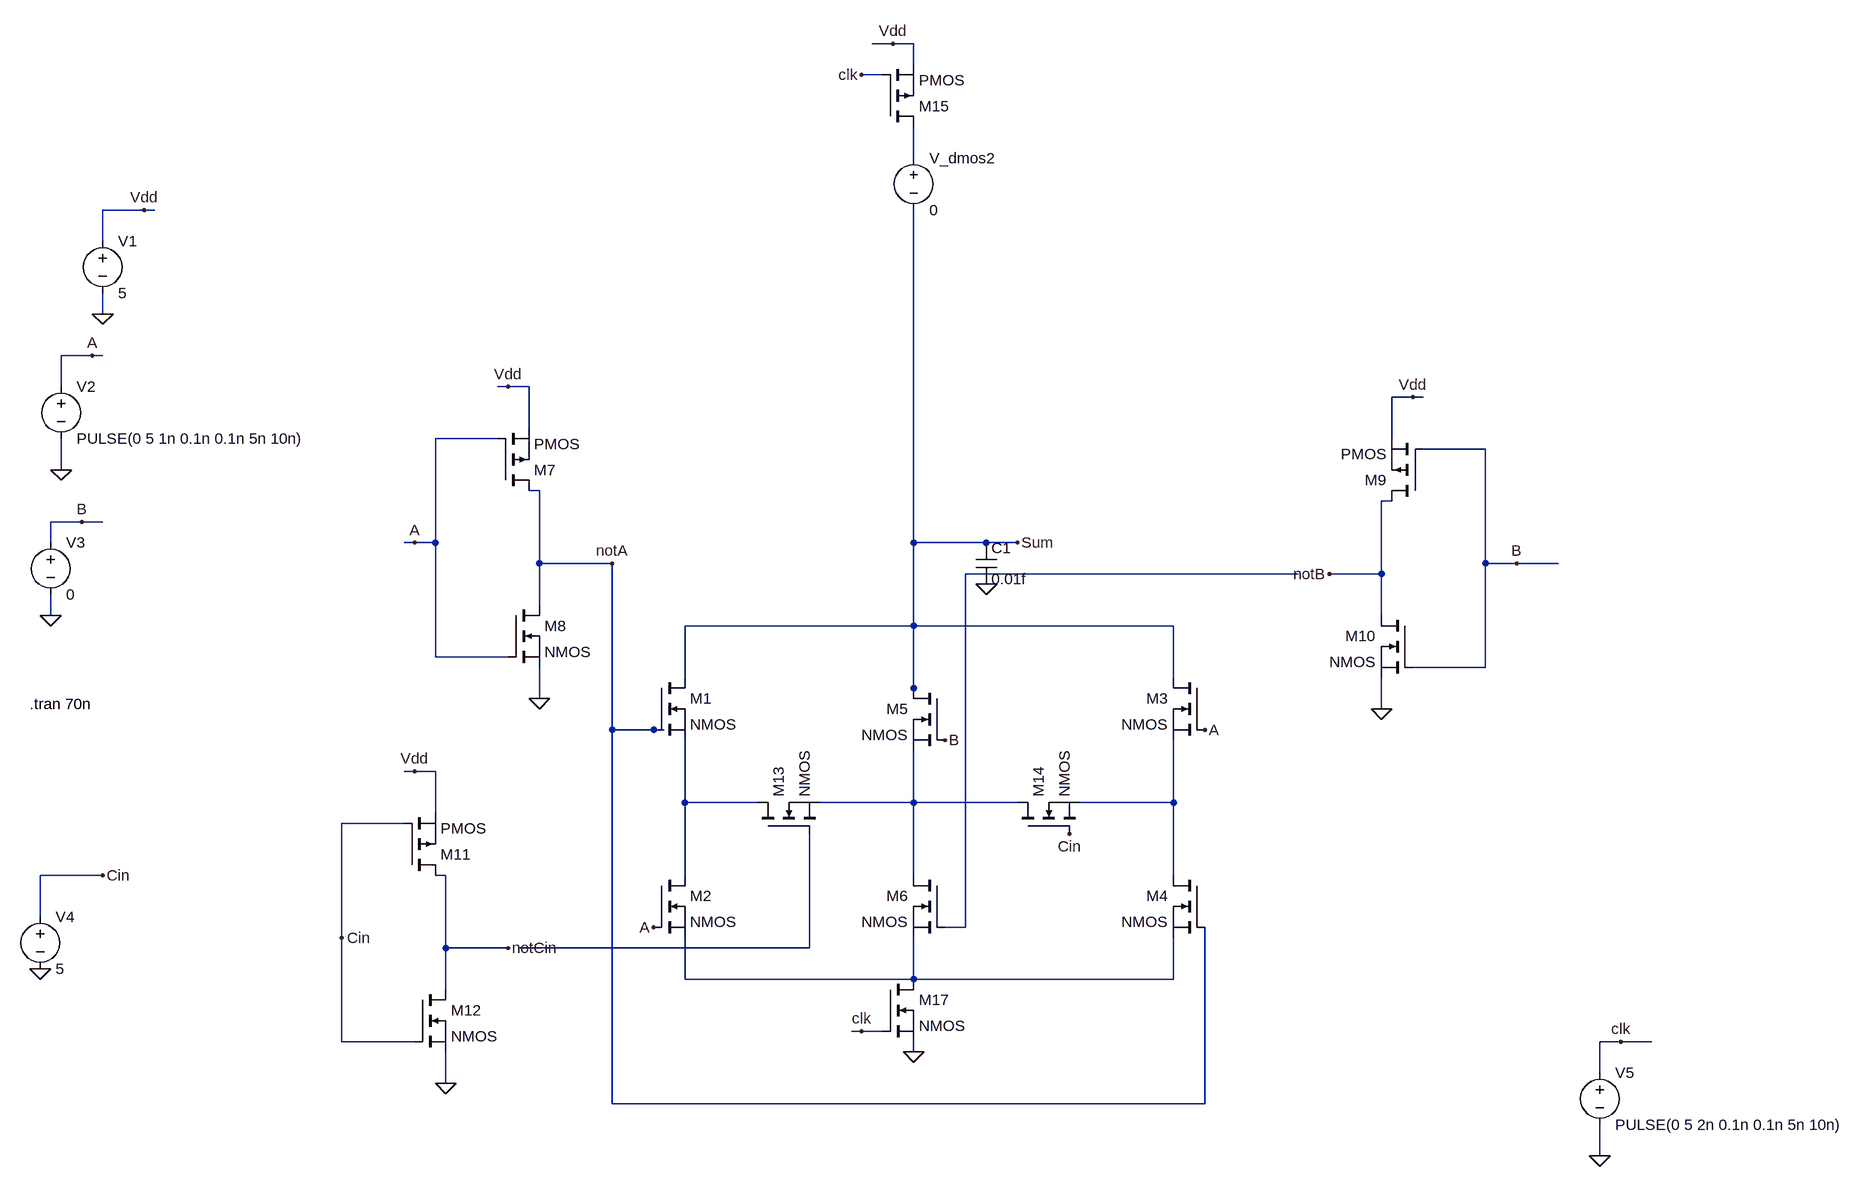
[diagram p0: schematic Sum3.asc]
Sum3.asc, the LTspice schematic file:
Version 4
SHEET 1 1772 932
WIRE 160 -816 128 -816
WIRE 192 -816 160 -816
WIRE 192 -784 192 -816
WIRE 144 -768 112 -768
WIRE 192 -640 192 -688
WIRE -992 -560 -1056 -560
WIRE -976 -560 -992 -560
WIRE -1056 -512 -1056 -560
WIRE -1056 -400 -1056 -432
WIRE -1072 -336 -1120 -336
WIRE -1056 -336 -1072 -336
WIRE -1120 -288 -1120 -336
WIRE -432 -288 -448 -288
WIRE -400 -288 -432 -288
WIRE 960 -272 928 -272
WIRE 976 -272 960 -272
WIRE -400 -224 -400 -288
WIRE -448 -208 -544 -208
WIRE 928 -208 928 -272
WIRE 1072 -192 976 -192
WIRE -1120 -160 -1120 -208
WIRE -384 -128 -400 -128
WIRE 928 -112 912 -112
WIRE -1088 -80 -1136 -80
WIRE -1056 -80 -1088 -80
WIRE -1136 -48 -1136 -80
WIRE -576 -48 -592 -48
WIRE -544 -48 -544 -208
WIRE -544 -48 -576 -48
WIRE 192 -48 192 -560
WIRE 304 -48 192 -48
WIRE 352 -48 304 -48
WIRE -384 -16 -384 -128
WIRE -272 -16 -384 -16
WIRE 1072 -16 1072 -192
WIRE 1120 -16 1072 -16
WIRE 1184 -16 1120 -16
WIRE 784 0 272 0
WIRE 912 0 912 -112
WIRE 912 0 832 0
WIRE -384 48 -384 -16
WIRE -1136 64 -1136 32
WIRE 912 64 912 0
WIRE 192 80 192 -48
WIRE 192 80 -160 80
WIRE 592 80 192 80
WIRE -544 128 -544 -48
WIRE -432 128 -544 128
WIRE 1072 144 1072 -16
WIRE 1072 144 960 144
WIRE -160 160 -160 80
WIRE 592 160 592 80
WIRE 192 176 192 80
WIRE -384 192 -384 144
WIRE 192 192 192 176
WIRE 912 208 912 160
WIRE -272 240 -272 -16
WIRE -208 240 -272 240
WIRE -192 240 -208 240
WIRE -576 304 -592 304
WIRE -544 304 -576 304
WIRE -160 352 -160 256
WIRE -48 352 -160 352
WIRE 192 352 192 272
WIRE 192 352 48 352
WIRE 352 352 192 352
WIRE 592 352 592 256
WIRE 592 352 448 352
WIRE -544 368 -544 304
WIRE -592 384 -688 384
WIRE -1056 464 -1152 464
WIRE -528 464 -544 464
WIRE -160 464 -160 352
WIRE 192 464 192 352
WIRE 592 464 592 352
WIRE -1152 528 -1152 464
WIRE 272 544 272 0
WIRE 272 544 240 544
WIRE -688 560 -688 384
WIRE -528 576 -528 464
WIRE -432 576 -528 576
WIRE 32 576 32 400
WIRE 32 576 -416 576
WIRE -160 624 -160 560
WIRE 192 624 192 560
WIRE 192 624 -160 624
WIRE 592 624 592 560
WIRE 592 624 192 624
WIRE -528 640 -528 576
WIRE 112 704 96 704
WIRE 144 704 112 704
WIRE -688 720 -688 560
WIRE -576 720 -688 720
WIRE 1280 720 1248 720
WIRE 1328 720 1280 720
WIRE 192 736 192 720
WIRE 1248 768 1248 720
WIRE -528 784 -528 736
WIRE -272 816 -272 240
WIRE 640 816 640 544
WIRE 640 816 -272 816
WIRE 1248 896 1248 848
FLAG -1056 -400 0
FLAG -992 -560 Vdd
FLAG -1120 -160 0
FLAG -1136 64 0
FLAG -1072 -336 A
FLAG -1088 -80 B
FLAG -384 192 0
FLAG -432 -288 Vdd
FLAG -576 -48 A
FLAG -272 -16 notA
FLAG 912 208 0
FLAG 960 -272 Vdd
FLAG 1120 -16 B
FLAG 832 0 notB
FLAG -208 544 A
FLAG 640 240 A
FLAG 240 256 B
FLAG -1152 608 0
FLAG -1056 464 Cin
FLAG -528 784 0
FLAG -576 304 Vdd
FLAG -688 560 Cin
FLAG -432 576 notCin
FLAG 352 -48 Sum
FLAG 432 400 Cin
FLAG 160 -816 Vdd
FLAG 112 -768 clk
FLAG 1248 896 0
FLAG 1280 720 clk
FLAG 192 736 0
FLAG 112 704 clk
FLAG 304 16 0
SYMBOL voltage -1056 -528 R0
WINDOW 123 0 0 Left 2
WINDOW 39 0 0 Left 2
SYMATTR InstName V1
SYMATTR Value 5
SYMBOL voltage -1120 -304 R0
WINDOW 123 0 0 Left 2
WINDOW 39 0 0 Left 2
SYMATTR InstName V2
SYMATTR Value PULSE(0 5 1n 0.1n 0.1n 5n 10n)
SYMBOL voltage -1136 -64 R0
WINDOW 123 0 0 Left 2
WINDOW 39 0 0 Left 2
SYMATTR InstName V3
SYMATTR Value 0
SYMBOL nmos -208 160 R0
SYMATTR InstName M1
SYMBOL nmos -208 464 R0
SYMATTR InstName M2
SYMBOL nmos 640 160 M0
SYMATTR InstName M3
SYMBOL nmos 640 464 M0
SYMATTR InstName M4
SYMBOL nmos 240 176 M0
SYMATTR InstName M5
SYMBOL nmos 240 464 M0
SYMATTR InstName M6
SYMBOL pmos -448 -128 M180
SYMATTR InstName M7
SYMBOL nmos -432 48 R0
SYMATTR InstName M8
SYMBOL pmos 976 -112 R180
SYMATTR InstName M9
SYMBOL nmos 960 64 M0
SYMATTR InstName M10
SYMBOL voltage -1152 512 R0
WINDOW 123 0 0 Left 0
WINDOW 39 0 0 Left 0
SYMATTR InstName V4
SYMATTR Value 5
SYMBOL pmos -592 464 M180
SYMATTR InstName M11
SYMBOL nmos -576 640 R0
SYMATTR InstName M12
SYMBOL nmos -48 400 R270
SYMATTR InstName M13
SYMBOL nmos 352 400 R270
SYMATTR InstName M14
SYMBOL voltage 192 -656 R0
WINDOW 123 0 0 Left 2
WINDOW 39 0 0 Left 2
SYMATTR InstName V_dmos2
SYMATTR Value 0
SYMBOL pmos 144 -688 M180
SYMATTR InstName M15
SYMBOL voltage 1248 752 R0
WINDOW 123 0 0 Left 2
WINDOW 39 0 0 Left 2
SYMATTR InstName V5
SYMATTR Value PULSE(0 5 2n 0.1n 0.1n 5n 10n)
SYMBOL nmos 144 624 R0
SYMATTR InstName M17
SYMBOL cap 288 -48 R0
SYMATTR InstName C1
SYMATTR Value 0.01f
TEXT -1168 200 Left 2 !.tran 70n

The netlist it stands for:
* Sum3.asc
V1 Vdd 0 5
V2 A 0 PULSE(0 5 1n 0.1n 0.1n 5n 10n)
V3 B 0 0
M1 Sum notA N003 N003 NMOS
M2 N003 A N007 N007 NMOS
M3 Sum A N005 N005 NMOS
M4 N005 notA N007 N007 NMOS
M5 Sum B N004 N004 NMOS
M6 N004 N002 N007 N007 NMOS
M7 notA A Vdd Vdd PMOS
M8 notA A 0 0 NMOS
M9 notB B Vdd Vdd PMOS
M10 notB B 0 0 NMOS
V4 Cin 0 5
M11 notCin Cin Vdd Vdd PMOS
M12 notCin Cin 0 0 NMOS
M13 N003 N006 N004 N004 NMOS
M14 N004 Cin N005 N005 NMOS
V_dmos2 N001 Sum 0
M15 N001 clk Vdd Vdd PMOS
V5 clk 0 PULSE(0 5 2n 0.1n 0.1n 5n 10n)
M17 N007 clk 0 0 NMOS
C1 Sum 0 0.01f
.model NMOS NMOS
.model PMOS PMOS
.lib standard.mos
.tran 70n
.backanno
.end